# EasyEDA Pro project JLCEDA_AT_START_A423_V1.1.epro, board AT-START-A423 V1.1
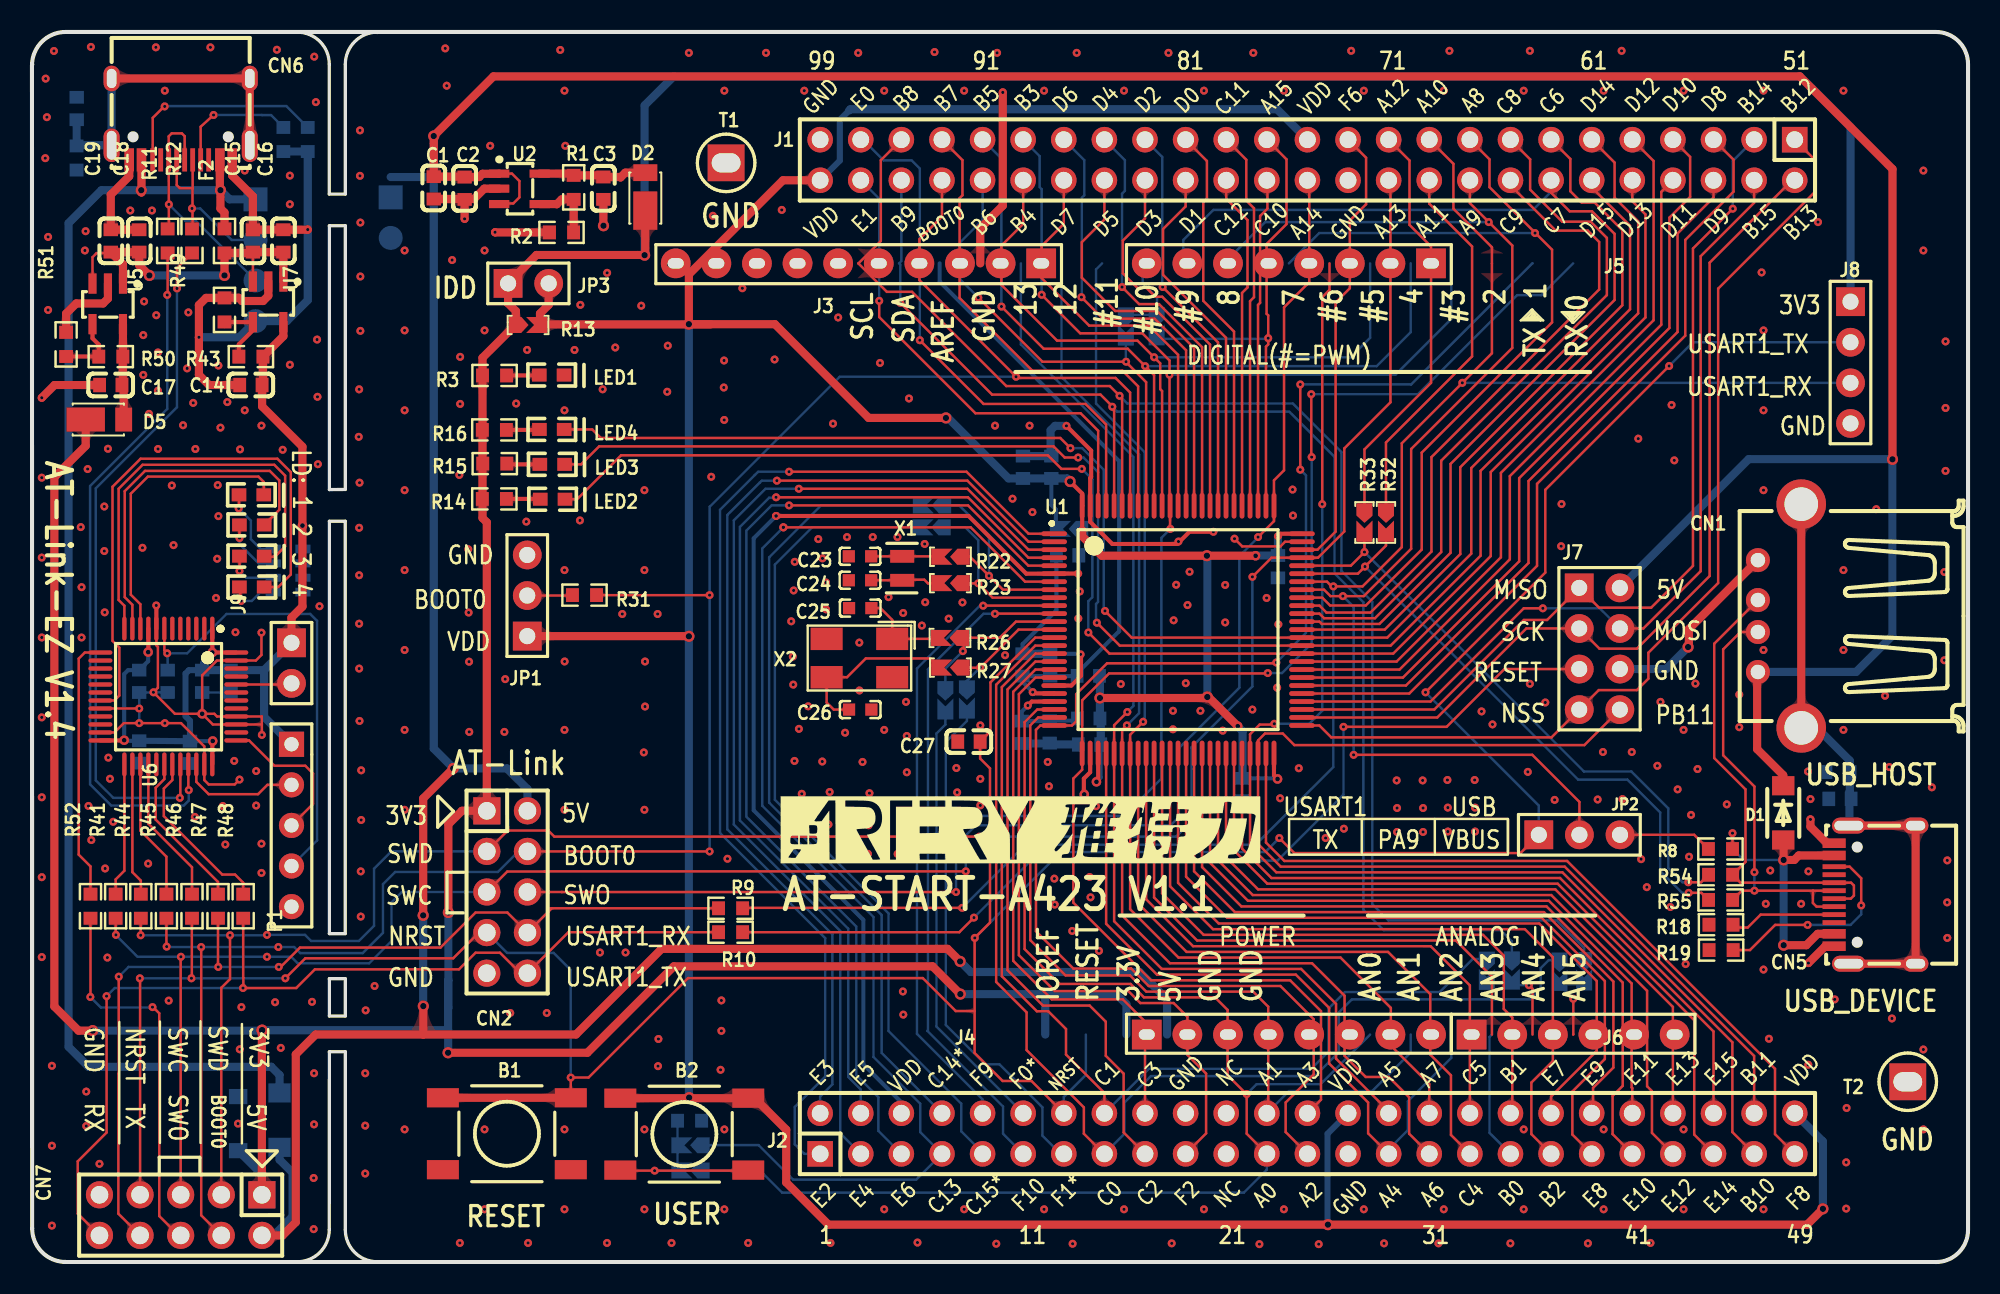
[diagram p4: board, top side]
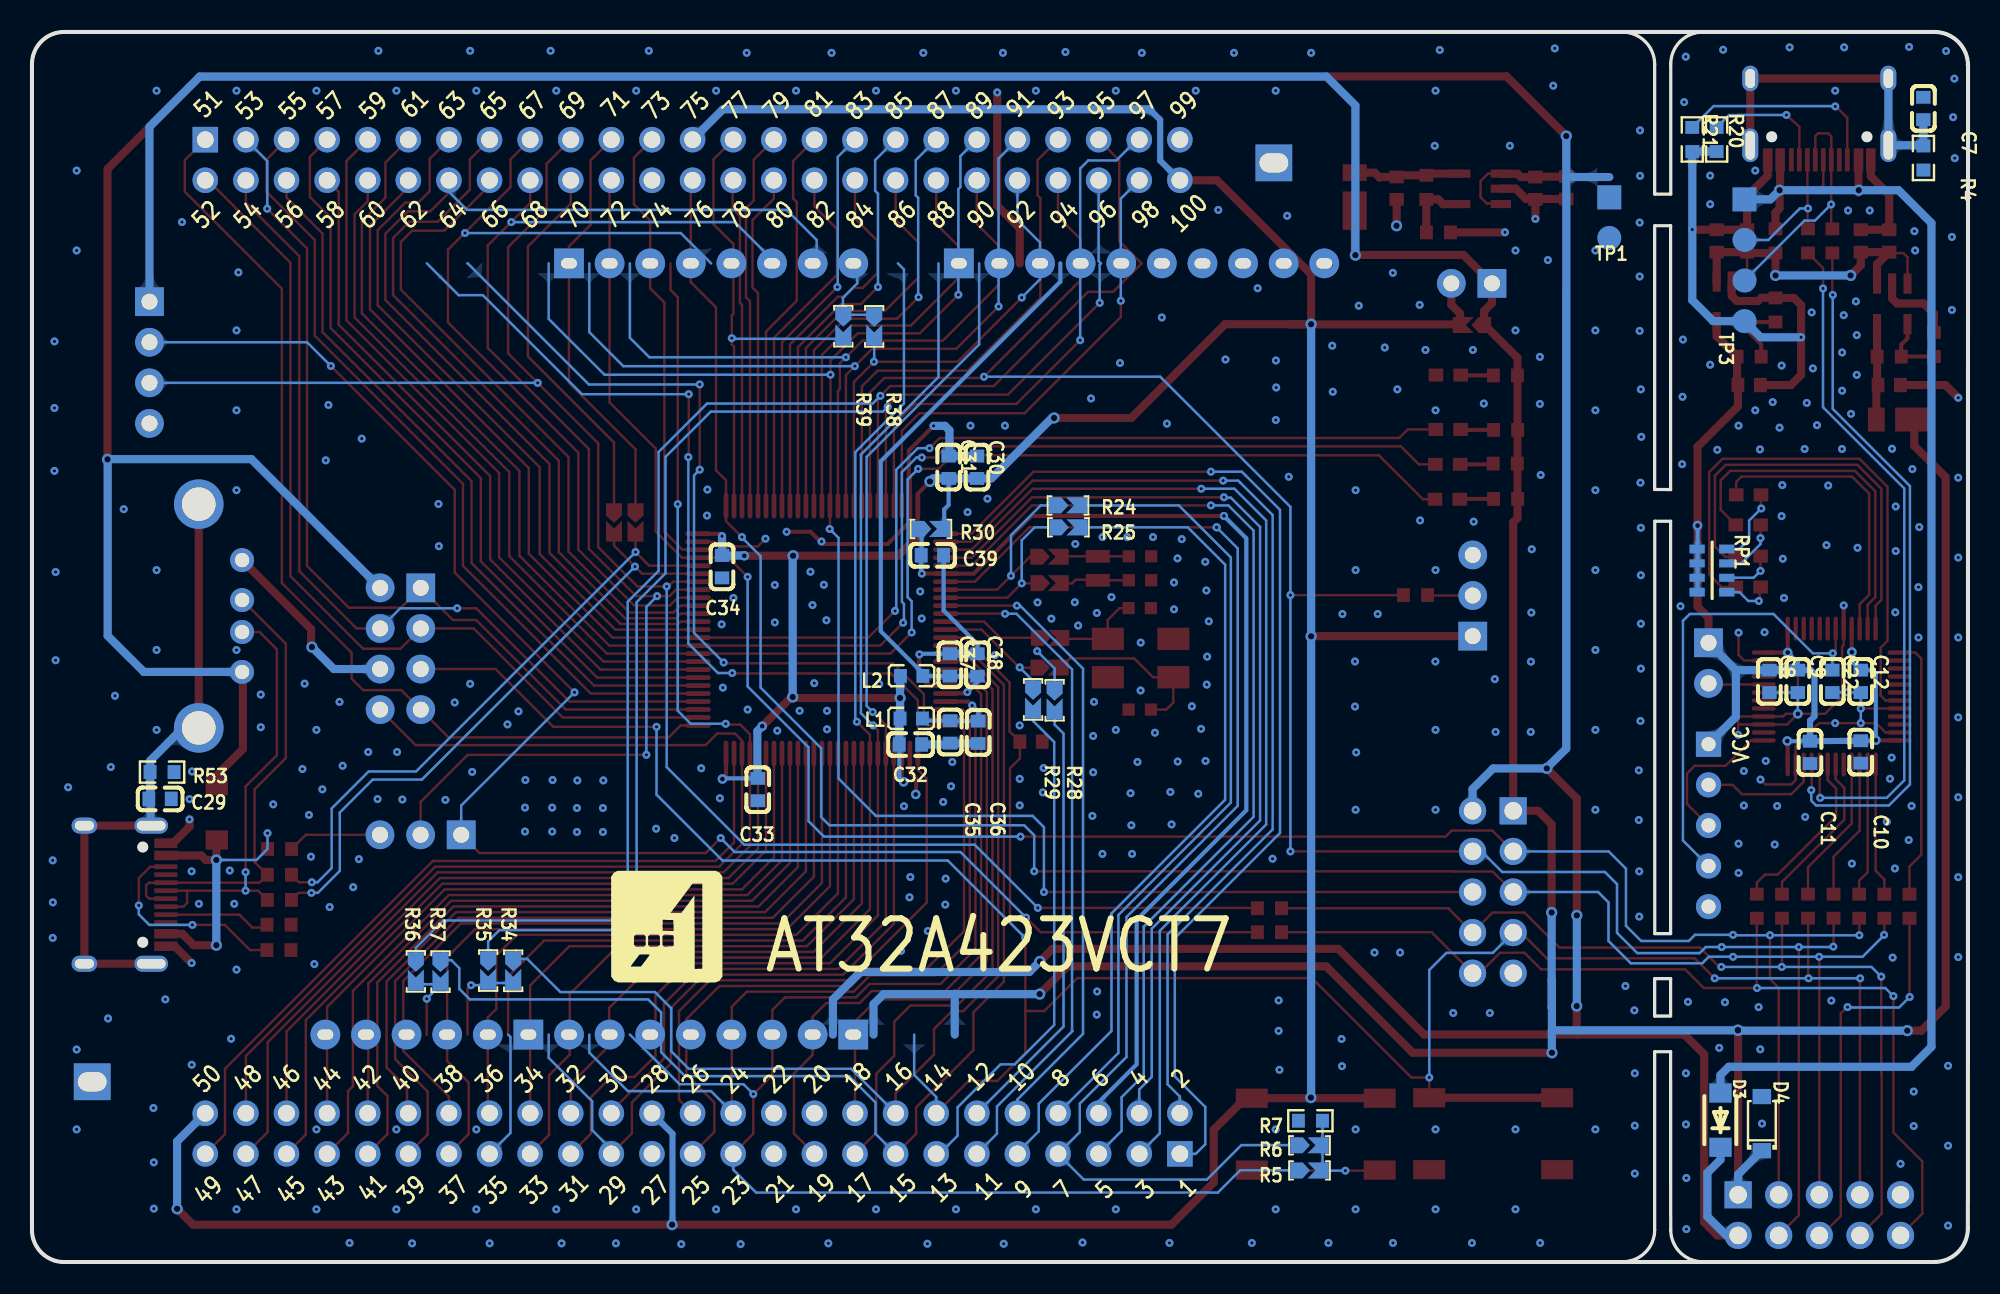
[diagram p5: board, bottom side, seen from below]

Outline 121.1 x 76.98 mm; copper layers: Top Layer, Bottom Layer. Coordinates in mm from the lower left corner of the outline.
Outline path: 0,74.87 0.01,2.11 arc(0.63,0.62) 2.12,0 ; 0,74.87 arc(0,74.9) 0.02,74.93 ; 0,74.87 arc(0.62,76.36) 2.1,76.98 119.09,76.98 arc(120.51,76.39) 121.1,74.97 121.1,2.01 arc(120.51,0.59) 119.09,0 119.09,0 21.6,0 ; 2.12,0 arc(2.1,0) 2.09,0.01 ; 2.12,0 21.57,0 arc(21.58,0) 21.6,0 ; 16.6,76.96 arc(18.01,76.38) 18.6,74.96 18.6,66.83 19.6,66.83 19.6,74.96 arc(20.19,76.37) 21.6,76.97 arc(21.6,76.97) 21.6,76.98 ; 16.52,0.02 arc(17.98,0.58) 18.6,2.02 18.6,13.16 19.6,13.16 19.6,2.02 arc(20.19,0.6) 21.6,0.02 ; 21.6,0 arc(21.59,0) 21.58,0 ; 18.6,20.55 19.59,20.55 19.59,46.36 18.6,46.36 18.6,20.55 ; 18.6,17.73 18.6,15.4 19.6,15.4 19.6,17.73 18.6,17.73 ; 18.6,64.85 18.6,48.34 19.6,48.35 19.6,64.85 18.6,64.85
Stack: Top Layer 0.035mm / Dielectric1 1.51mm FR4 er 4.5 / Bottom Layer 0.035mm

## Design rules (mm)
spacing Default (default): track to track 0.203, other pairs 0 to 0.152
track width Default (default): min 0.152, default 0.152, max 25.4
differential pair differentialPair (default): width min 0.127, default 0.254, max 2.54; gap min 0.152, default 0.152
via Default (default): diameter min 0.5, default 0.5, max 100.025; hole min 0.201, default 0.201, max 59.995

## Placement (name value [footprint] x y rotation side)
B1  BUTTON_SMT,6.0x6.0x4.5mm  [BUTTON_SMT_6*6*5]  29.7 8.03 0 top
B2  BUTTON_SMT,6.0x6.0x4.5mm  [BUTTON_SMT_6*6*5]  40.8 8 0 top
C1  10uF  [C0603]  25.13 67.22 90 top
C2  100nF  [C0603]  27.06 67.2 90 top
C3  10uF  [C0603]  35.74 67.2 90 top
C7  100nF  [C0603]  2.79 72.19 270 bottom
C8  4.7uF  [C0603]  12.42 36.34 90 bottom
C9  100nF  [C0603]  10.64 36.34 90 bottom
C10  100nF  [C0603]  6.71 31.92 90 bottom
C11  100nF  [C0603]  9.88 31.89 90 bottom
C12  100nF  [C0603]  6.71 36.34 90 bottom
C14  10uF  [C0603]  13.69 54.88 0 top
C15  10uF  [C0603]  13.82 63.9 270 top
C16  100nF  [C0603]  15.73 63.9 270 top
C17  10uF  [C0603]  4.93 54.88 0 top
C18  10uF  [C0603]  6.71 63.9 270 top
C19  100nF  [C0603]  4.93 63.9 270 top
C22  100nF  [C0603]  8.49 36.34 90 bottom
C23  10pF  [0603_C-M]  51.79 44.16 180 top
C24  10pF  [0603_C-M]  51.79 42.66 180 top
C25  22pF  [0603_C-M(1)]  51.81 40.92 180 top
C26  22pF  [0603_C-M(1)]  51.81 34.57 0 top
C27  100nF  [C0603]  58.61 32.57 0 top
C29  100nF  [C0603]  113.09 28.98 0 bottom
C30  4.7uF  [C0603]  61.99 49.74 270 bottom
C31  100nF  [C0603]  63.76 49.74 270 bottom
C32  100nF  [C0603]  66.15 32.39 0 bottom
C33  100nF  [C0603]  75.7 29.57 90 bottom
C34  100nF  [C0603]  77.94 43.51 90 bottom
C35  1uF  [C0603]  63.66 33.18 90 bottom
C36  100nF  [C0603]  61.91 33.15 90 bottom
C37  1uF  [C0603]  63.69 37.37 270 bottom
C38  100nF  [C0603]  61.96 37.37 270 bottom
C39  100nF  [C0603]  64.78 44.22 0 bottom
CN1  902-131A1011D10100  [USB-A-TH__USB-AF-90]  109.31 40.43 90 top
CN2  -  [HDR-TH_10P-P2.54-V-M-R2-C5-S2.54]  29.72 23.16 270 top
CN5  -  [USB-C-SMD_TYPEC-304-BCP16]  115.28 22.99 90 top
CN6  -  [USB-C-SMD_TYPEC-304-BCP16]  9.3 71.52 180 top
CN7  -  [HDR-TH_10P-P2.54-V-M-R2-C5-S2.54]  9.3 2.94 180 top
D1  1N5819HW-7-F  [SOD-123_L2.8-W1.8-LS3.7-FD]  109.54 28.11 90 top
D2  DFLS130L-7  [POWERDI-123_L2.8-W1.8-LS3.7-RD]  38.36 66.98 90 top
D3  1N5819HW-7-F  [SOD-123_L2.8-W1.8-LS3.7-FD]  15.49 8.88 270 bottom
D4  SMF3.3A  [SOD-123_L2.8-W1.8-LS3.7-RD]  12.9 8.66 90 bottom
D5  DFLS130L-7  [POWERDI-123_L2.8-W1.8-LS3.7-RD]  4.55 52.72 0 top
F2  SMD0603B050TF  [R0603]  12.04 63.9 270 top
J1  X6521WV-2x25H-C30D60  [HDR-TH_50P-2.54-V-M-R2-C25-S2.54]  79.78 68.96 180 top
J2  X6521WV-2x25H-C30D60  [HDR-TH_50P-2.54-V-M-R2-C25-S2.54]  79.78 8.04 0 top
J3  -  [AT-START-Connector 1x10]  63.13 62.5 180 top
J4  -  [AT-START-Connector 1x8]  69.73 14.24 0 top
J5  -  [AT-START-Connector 1x8]  87.51 62.5 180 top
J6  -  [AT-START-Connector 1x6]  90.05 14.24 0 top
J7  Header 4X2  [HDR2X4]  96.78 42.19 270 top
J8  Header 1x4  [HDR1X4]  113.75 60.1 270 top
J9  1X2P,Male,DIP_2.54  [HDR1X2]  16.23 38.75 270 top
JP1  Header 1x3  [HEADER 1X3]  30.98 39.17 90 top
JP2  Header 1x3  [HEADER 1X3]  94.25 26.74 0 top
JP3  NC(Header 1x2)  [HDR1X2]  29.78 61.24 0 top
L1  -  [L0603]  66.1 34.01 180 bottom
L2  -  [L0603]  66.08 36.68 180 bottom
LD1  RED  [LED0603]  12.95 48 0 top
LD2  GREEN  [LED0603]  12.98 46.12 0 top
LD3  BLUE  [LED0603]  12.98 44.17 0 top
LD4  YELLOW  [LED0603]  12.98 42.24 0 top
LED1  RED  [LED0603]  31.73 55.5 0 top
LED2  RED  [LED0603]  31.79 47.73 0 top
LED3  YELLOW  [LED0603]  31.77 49.91 0 top
LED4  GREEN  [LED0603]  31.74 52.1 0 top
P1  HDR-M-2.54_1x5  [HDR-M-2.54_1X5]  16.23 27.32 270 top
R1  51kΩ  [R0603]  33.89 67.25 90 top
R2  15kΩ  [R0603]  33.12 64.43 0 top
R3  1kΩ  [R0603]  28.94 55.48 180 top
R4  1MΩ  [R0603]  2.79 69.09 270 bottom
R5  0Ω  [SB-PAD]  41.19 5.73 180 bottom
R6  NC  [SB-PAD]  41.19 7.31 180 bottom
R7  100kΩ  [R0603]  41.13 8.84 180 bottom
R8  10kΩ  [R0603]  105.61 25.85 0 top
R9  470Ω  [R0603]  43.7 22.14 0 top
R10  470Ω  [R0603]  43.7 20.64 0 top
R11  0Ω  [R0603]  8.49 63.9 270 top
R12  0Ω  [R0603]  10.01 63.9 270 top
R13  0Ω  [SB-PAD]  31.03 58.64 0 top
R14  1kΩ  [R0603]  28.92 47.75 180 top
R15  1kΩ  [R0603]  28.95 49.96 180 top
R16  1kΩ  [R0603]  28.92 52.07 180 top
R18  5.1kΩ  [R0603]  105.65 21.11 180 top
R19  5.1kΩ  [R0603]  105.66 19.52 180 top
R20  5.1kΩ  [R0603]  15.73 70.25 270 bottom
R21  5.1kΩ  [R0603]  17.25 70.25 270 bottom
R22  0Ω  [SB-PAD]  57.45 44.14 180 top
R23  0Ω  [SB-PAD]  57.45 42.48 180 top
R24  NC  [SB-PAD]  56.3 47.35 180 bottom
R25  NC  [SB-PAD]  56.27 45.98 180 bottom
R26  0Ω  [SB-PAD]  57.42 39.06 180 top
R27  0Ω  [SB-PAD]  57.45 37.2 180 top
R28  NC  [SB-PAD]  57.13 35.15 270 bottom
R29  NC  [SB-PAD]  58.48 35.21 270 bottom
R30  0Ω  [SB-PAD]  64.87 45.88 180 bottom
R31  10kΩ  [R0603]  34.56 41.73 0 top
R32  NC  [SB-PAD]  84.69 46.28 270 top
R33  NC  [SB-PAD]  83.35 46.28 270 top
R34  0Ω  [sb-pad]  91 18.23 270 bottom
R35  NC  [sb-pad]  92.57 18.24 270 bottom
R36  NC  [sb-pad]  97.09 18.19 270 bottom
R37  0Ω  [sb-pad]  95.55 18.17 270 bottom
R38  NC  [SB-PAD]  68.42 58.55 270 bottom
R39  0Ω  [SB-PAD]  70.35 58.56 270 bottom
R41  33Ω  [R0603]  5.23 22.27 270 top
R43  47kΩ  [R0603]  13.69 56.66 0 top
R44  33Ω  [R0603]  6.81 22.27 270 top
R45  33Ω  [R0603]  8.41 22.27 270 top
R46  33Ω  [R0603]  10.01 22.27 270 top
R47  33Ω  [R0603]  11.64 22.27 270 top
R48  33Ω  [R0603]  13.21 22.27 270 top
R49  15kΩ  [R0603]  12.04 59.58 270 top
R50  51kΩ  [R0603]  4.93 56.66 0 top
R51  15kΩ  [R0603]  2.14 57.42 270 top
R52  33Ω  [R0603]  3.66 22.27 270 top
R53  1MΩ  [R0603]  112.96 30.66 180 bottom
R54  0Ω  [R0603]  105.62 24.23 0 top
R55  0Ω  [R0603]  105.62 22.66 0 top
RP1  1K  [0603*4,8P4R]  16.94 44.62 270 bottom
T1  Testpoint  [TESTHOOK]  43.42 68.79 0 top
T2  Testpoint  [TESTHOOK]  117.33 11.28 180 top
TP1  -  [AT-START-TEST-POINT 1X2]  22.44 66.63 270 bottom
TP3  1X4P_2.54F  [HDR1X4 - TOP]  13.98 66.5 90 bottom
U1  -  [LQFP-100_L14.0-W14.0-P0.50-LS16.0-TL]  71.69 39.58 0 top
U2  RT9080N-08GJ5  [SOT-23-5(1)]  30.87 65.57 0 top
U5  RT9080N-08GJ5  [SOT-23-5]  3.15 59.58 270 top
U6  -  [LQFP-48_L7.0-W7.0-P0.50-LS9.0-BL]  8.53 35.39 180 top
U7  RT9080N-08GJ5  [SOT-23-5(1)]  13.19 59.71 270 top
X1  32.768KHz  [XTAL_SOP - FC-12M]  54.43 44.16 270 top
X2  8MHz  [OSC-SMD_4P-L5.0-W3.2-BL]  51.76 37.8 180 top

## Footprints (pads in the part's own frame, mm; a bottom-side part is the same pattern mirrored in y, then rotated)
0603*4,8P4R
  rect 0.55x0.95 smd: 1(0,0) 4(2.7,0) 5(2.7,1.85) 8(0,1.85)
  rect 0.5x0.95 smd: 2(0.9,0) 3(1.8,0) 6(1.8,1.85) 7(0.9,1.85)
0603_C-M
  rect 0.762x0.762 smd: 1(0.699,0) 2(-0.699,0)
0603_C-M(1)
  rect 0.762x0.762 smd: 1(0.699,0) 2(-0.699,0)
AT-START-Connector 1x6
  rect 1.86x1.86 hole 1x0.65: 1(0,0)
  round 1.86 hole 1x0.65: 2(2.54,0) 3(5.08,0) 4(7.62,0) 5(10.16,0) 6(12.7,0)
AT-START-Connector 1x8
  rect 1.86x1.86 hole 1x0.65: 1(0,0)
  round 1.86 hole 1x0.65: 2(2.54,0) 3(5.08,0) 4(7.62,0) 5(10.16,0) 6(12.7,0) 7(15.24,0) 8(17.78,0)
AT-START-Connector 1x10
  rect 1.86x1.86 hole 1x0.65: 1(0,0)
  round 1.86 hole 1x0.65: 2(2.54,0) 3(5.08,0) 4(7.62,0) 5(10.16,0) 6(12.7,0) 7(15.24,0) 8(17.78,0) 9(20.32,0) 10(22.86,0)
AT-START-TEST-POINT 1X2
  rect 1.5x1.5 smd: 1(0,0)
  round 1.5 smd: 2(2.54,0)
BUTTON_SMT_6*6*5
  rect 2x1.2 smd: 1(-4,2.25) 2(4,2.25) 3(-4,-2.25) 4(4,-2.25)
C0603
  rect 0.8x0.9 smd: 1(-0.7,0) 2(0.7,0)
HDR1X2
  rect 1.8x1.8 hole 1.005x1: 1(0,0)
  round 1.8 hole 1.005x1: 2(2.54,0)
HDR1X4
  rect 1.8x1.8 hole 1: 1(0,0)
  round 1.8 hole 1: 2(2.54,0) 3(5.08,0) 4(7.62,0)
HDR1X4 - TOP
  rect 1.5x1.5 smd: 1(0,0)
  round 1.5 smd: 2(-2.54,0) 3(-5.08,0) 4(-7.62,0)
HDR2X4
  rect 1.8x1.8 hole 1: 1(0,0)
  round 1.8 hole 1: 2(0,2.54) 3(2.54,0) 4(2.54,2.54) 5(5.08,0) 6(5.08,2.54) 7(7.62,0) 8(7.62,2.54)
HDR-M-2.54_1X5
  rect 1.575x1.575 hole 0.889: 1(-5.08,0)
  round 1.575 hole 0.889: 2(-2.54,0) 3(0,0) 4(2.54,0) 5(5.08,0)
HDR-TH_10P-P2.54-V-M-R2-C5-S2.54
  rect 1.7x1.7 hole 1.1: 1(-5.08,-1.27)
  round 1.7 hole 1.1: 2(-5.08,1.27) 3(-2.54,-1.27) 4(-2.54,1.27) 5(0,-1.27) 6(0,1.27) 7(2.54,-1.27) 8(2.54,1.27) 9(5.08,-1.27) 10(5.08,1.27)
HDR-TH_50P-2.54-V-M-R2-C25-S2.54
  rect 1.6x1.6 hole 1.049: 1(-30.48,-1.27)
  round 1.6 hole 1.049: 2(-30.48,1.27) 3(-27.94,-1.27) 4(-27.94,1.27) 5(-25.4,-1.27) 6(-25.4,1.27) 7(-22.86,-1.27) 8(-22.86,1.27) 9(-20.32,-1.27) 10(-20.32,1.27) 11(-17.78,-1.27) 12(-17.78,1.27) 13(-15.24,-1.27) 14(-15.24,1.27) 15(-12.7,-1.27) 16(-12.7,1.27) 17(-10.16,-1.27) 18(-10.16,1.27) 19(-7.62,-1.27) 20(-7.62,1.27) 21(-5.08,-1.27) 22(-5.08,1.27) 23(-2.54,-1.27) 24(-2.54,1.27) 25(0,-1.27) 26(0,1.27) 27(2.54,-1.27) 28(2.54,1.27) 29(5.08,-1.27) 30(5.08,1.27) 31(7.62,-1.27) 32(7.62,1.27) 33(10.16,-1.27) 34(10.16,1.27) 35(12.7,-1.27) 36(12.7,1.27) 37(15.24,-1.27) 38(15.24,1.27) 39(17.78,-1.27) 40(17.78,1.27) 41(20.32,-1.27) 42(20.32,1.27) 43(22.86,-1.27) 44(22.86,1.27) 45(25.4,-1.27) 46(25.4,1.27) 47(27.94,-1.27) 48(27.94,1.27) 49(30.48,-1.27) 50(30.48,1.27)
HEADER 1X3
  rect 1.8x1.8 hole 1.005x1: 1(0,-0.001)
  round 1.8 hole 1.005x1: 2(2.54,-0.001) 3(5.08,-0.001)
L0603
  rect 0.8x0.864 smd: 1(-0.701,0) 2(0.701,0)
LED0603
  rect 0.914x0.813 smd: 1(-0.001,0.005) 2(1.548,0.005)
LQFP-48_L7.0-W7.0-P0.50-LS9.0-BL
  oval 0.27x1.5 smd: 1(-2.75,-4.25) 2(-2.25,-4.25) 3(-1.75,-4.25) 4(-1.25,-4.25) 5(-0.75,-4.25) 6(-0.25,-4.25) 7(0.25,-4.25) 8(0.75,-4.25) 9(1.25,-4.25) 10(1.75,-4.25) 11(2.25,-4.25) 12(2.75,-4.25) 25(2.75,4.25) 26(2.25,4.25) 27(1.75,4.25) 28(1.25,4.25) 29(0.75,4.25) 30(0.25,4.25) 31(-0.25,4.25) 32(-0.75,4.25) 33(-1.25,4.25) 34(-1.75,4.25) 35(-2.25,4.25) 36(-2.75,4.25)
  oval 1.5x0.27 smd: 13(4.25,-2.75) 14(4.25,-2.25) 15(4.25,-1.75) 16(4.25,-1.25) 17(4.25,-0.75) 18(4.25,-0.25) 19(4.25,0.25) 20(4.25,0.75) 21(4.25,1.25) 22(4.25,1.75) 23(4.25,2.25) 24(4.25,2.75) 37(-4.25,2.75) 38(-4.25,2.25) 39(-4.25,1.75) 40(-4.25,1.25) 41(-4.25,0.75) 42(-4.25,0.25) 43(-4.25,-0.25) 44(-4.25,-0.75) 45(-4.25,-1.25) 46(-4.25,-1.75) 47(-4.25,-2.25) 48(-4.25,-2.75)
LQFP-100_L14.0-W14.0-P0.50-LS16.0-TL
  oval 1.6x0.299 smd: 1(-7.75,6) 2(-7.75,5.499) 3(-7.75,5.002) 4(-7.75,4.501) 5(-7.75,4) 6(-7.75,3.5) 7(-7.75,2.999) 8(-7.75,2.499) 9(-7.75,1.999) 10(-7.75,1.501) 11(-7.75,1.001) 12(-7.75,0.5) 13(-7.75,0) 14(-7.75,-0.5) 15(-7.75,-1.001) 16(-7.75,-1.501) 17(-7.75,-1.999) 18(-7.75,-2.499) 19(-7.75,-2.999) 20(-7.75,-3.5) 21(-7.75,-4) 22(-7.75,-4.501) 23(-7.75,-4.998) 24(-7.75,-5.499) 25(-7.75,-6) 51(7.75,-6) 52(7.75,-5.499) 53(7.75,-4.998) 54(7.75,-4.501) 55(7.75,-4) 56(7.75,-3.5) 57(7.75,-2.999) 58(7.75,-2.499) 59(7.75,-1.999) 60(7.75,-1.501) 61(7.75,-1.001) 62(7.75,-0.5) 63(7.75,0) 64(7.75,0.5) 65(7.75,1.001) 66(7.75,1.501) 67(7.75,1.999) 68(7.75,2.499) 69(7.75,2.999) 70(7.75,3.5) 71(7.75,4) 72(7.75,4.501) 73(7.75,5.002) 74(7.75,5.499) 75(7.75,6)
  oval 0.299x1.6 smd: 26(-6,-7.75) 27(-5.499,-7.75) 28(-4.998,-7.75) 29(-4.501,-7.75) 30(-4,-7.75) 31(-3.5,-7.75) 32(-2.999,-7.75) 33(-2.499,-7.75) 34(-1.999,-7.75) 35(-1.501,-7.75) 36(-1.001,-7.75) 37(-0.5,-7.75) 38(0,-7.75) 39(0.5,-7.75) 40(1.001,-7.75) 41(1.501,-7.75) 42(1.999,-7.75) 43(2.499,-7.75) 44(2.999,-7.75) 45(3.5,-7.75) 46(4,-7.75) 47(4.501,-7.75) 48(5.002,-7.75) 49(5.499,-7.75) 50(6,-7.75) 76(6,7.75) 77(5.499,7.75) 78(5.002,7.75) 79(4.501,7.75) 80(4,7.75) 81(3.5,7.75) 82(2.999,7.75) 83(2.499,7.75) 84(1.999,7.75) 85(1.501,7.75) 86(1.001,7.75) 87(0.5,7.75) 88(0,7.75) 89(-0.5,7.75) 90(-1.001,7.75) 91(-1.501,7.75) 92(-1.999,7.75) 93(-2.499,7.75) 94(-2.999,7.75) 95(-3.5,7.75) 96(-4,7.75) 97(-4.501,7.75) 98(-4.998,7.75) 99(-5.499,7.75) 100(-6,7.75)
OSC-SMD_4P-L5.0-W3.2-BL
  rect 2x1.4 smd: 1(-2.05,-1.2) 2(2.05,-1.2) 3(2.05,1.2) 4(-2.05,1.2)
POWERDI-123_L2.8-W1.8-LS3.7-RD
  rect 2.4x1.5 smd: 1(-1.188,0)
  rect 1.05x1.5 smd: 2(1.188,0)
R0603
  rect 0.806x0.864 smd: 1(-0.753,0) 2(0.753,0)
SB-PAD
  custom 1.226x1 smd: 1(-0.587,0)
  custom 1.319x1 smd: 2(0.54,0)
sb-pad
  custom 1.319x1 smd: 1(0.54,0)
  custom 1.226x1 smd: 2(-0.587,0)
SOD-123_L2.8-W1.8-LS3.7-FD
  rect 1.199x1.399 smd: 1(-1.7,0) 2(1.7,0)
SOD-123_L2.8-W1.8-LS3.7-RD
  rect 0.95x1.15 smd: 1(-1.692,0) 2(1.692,0)
SOT-23-5
  rect 1.27x0.508 smd: 1(-1.651,2.54) 2(-1.651,1.6) 3(-1.651,0.635) 4(0.889,0.635) 5(0.889,2.54)
SOT-23-5(1)
  rect 1.27x0.508 smd: 1(-1.651,2.54) 2(-1.651,1.6) 3(-1.651,0.635) 4(0.889,0.635) 5(0.889,2.54)
TESTHOOK
  rect 2.3x2.3 hole 1.8x1.2: 1(0,0)
USB-A-TH__USB-AF-90
  round 1.5 hole 0.9: 1(-3.5,1.355) 2(-1,1.355) 3(1,1.355) 4(3.5,1.355)
  round 3.1 hole 2.1: SH1(7,-1.355) SH2(-7,-1.355)
USB-C-SMD_TYPEC-304-BCP16
  oval 1.001x2.1 hole 0.6x1.801: 13(-4.321,1.633) 14(4.321,1.633)
  oval 1.001x1.6 hole 0.6x1.199: 15(-4.321,-2.547) 16(4.321,-2.547)
  rect 0.6x1.45 smd: A1B12(-3.226,2.547) A4B9(-2.451,2.547) B1A12(3.22,2.547) B4A9(2.451,2.547)
  rect 0.299x1.45 smd: A5(-1.25,2.547) A6(-0.249,2.547) A7(0.249,2.547) A8(1.25,2.547) B5(1.75,2.547) B6(0.75,2.547) B7(-0.75,2.547) B8(-1.75,2.547)
XTAL_SOP - FC-12M
  rect 0.8x1.5 smd: 1(0,0) 2(1.5,0)

## Nets
As in the schematic, except:
VBAT: C39.2 J2.6 R30.1 U1.6
VDD: B2.1 B2.2 C30.2 C31.2 C32.2 C33.2 C34.2 J1.25 J1.50 J2.28 J2.50 JP1.1 JP3.2 L1.1 L2.1 R13.2 R30.2 U1.28 U1.50 U1.75 U1.100

Pads without a net: CN5 A8 B8; CN6 A8 B8; J2 21 22; J4 1 8; U6 2 3 4 5 6 14 15 16 17 18 21 22 29 38 41 42 43 45 46

## Via types
v1: diameter 0.5, hole 0.201, Top Layer to Bottom Layer, 187 vias
v2: diameter 0.5, hole 0.2, Top Layer to Bottom Layer, 387 vias
v3: diameter 0.6, hole 0.3, Top Layer to Bottom Layer, 11 vias
v4: diameter 0.7, hole 0.4, Top Layer to Bottom Layer, 31 vias

## Routing (per net, layer and track width the routed paths; a pad name or vN(x,y) marks a point on that pad's centre or on a via; arc(x,y) is an arc through that point)
3V3: length 289.6
  Top Layer w0.254: 28.17,49.99 R15.2 ; 28.2,47.78 R14.2
  Top Layer w0.508: 28.18,52.08 R3.2 28.18,56.59 30.27,58.68 30.27,59.51 29.78,60 JP3.1 31.56,63.02 38.31,63.02 v4(38.32,63.01) 38.36,63.05 D2.1 ; 28.18,52.08 R16.2 ; 28.18,52.08 28.18,46.56 28.45,46.29 CN2.1 26.89,28.24 26.05,27.39 v4(26.05,21.87) ; v4(26.03,13.1) 34.74,13.1 40.15,18.51 56.33,18.51 v4(58.07,16.77) ; v4(3.8,14.48) 2.91,14.48 1.4,15.99 1.4,49.12 3.36,51.08 D5.1 ; 14.38,14.49 CN7.1
  Bottom Layer w0.508: 68.46,14.24 68.46,16.13 67.83,16.77 63.41,16.77 ; 26.05,17.63 26.05,15.9 26.03,15.9 ; 26.05,17.63 v4(26.05,21.87) ; 26.05,17.63 26.03,17.61 26.03,15.9 ; v4(38.32,63.01) 38.32,72.38 40.12,74.18 110.61,74.18 113.75,71.04 J8.1 ; 26.03,14.51 v4(14.39,14.51) 14.37,14.48 v4(3.8,14.48) ; 26.03,14.51 26.03,13.1 v4(26.03,13.1) ; 26.03,14.51 26.03,14.51 26.03,15.9 ; 63.38,16.77 v4(58.07,16.77) 58.06,16.78 ; 63.38,16.77 63.38,14.24 ; 63.38,16.77 63.41,16.77 ; D4.1 14.38,5.49 CN7.1 ; 63.41,16.77 63.38,16.79
5V: length 320.1
  Top Layer w0.152: U2.1 30.02,68.11 30.49,67.64 30.49,66.63 30.11,66.25 29.26,66.25 U2.3
  Top Layer w0.508: U2.1 29.21,68.1 28.18,68.1 27.97,67.9 C2.2 27.04,67.92 C1.2 v4(25.13,70.46) 28.86,74.2 110.58,74.2 116.38,68.4 v4(116.38,50.23) ; D1.2 109.54,30.46 107.91,32.1 107.91,36.88 CN1.1 ; 24.48,14.24 34.03,14.24 39.39,19.6 57.27,19.6 v4(58.06,18.81) ; 24.48,14.24 24.48,14.24 v4(24.48,16.02) ; 24.48,14.24 17.75,14.24 16.5,12.99 16.5,2.49 15.68,1.67 CN7.2 ; v4(26.35,30.89) 24.47,29.01 v4(24.47,21.69)
  Bottom Layer w0.508: v4(58.06,18.81) 58.72,18.15 69.28,18.15 71,16.43 71,14.24 ; CN7.2 15.12,1.67 16.3,2.85 16.3,5.59 15.49,6.4 D3.2 ; J7.2 107.38,50.24 116.37,50.24 116.37,39.2 114.1,36.93 CN1.1 ; 25.13,67.87 25.1,67.9 22.44,67.9 ; v4(24.47,21.69) 24.47,16.03 v4(24.48,16.02) ; CN2.2 30.99,29.6 29.7,30.89 26.38,30.89 25.13,32.13 v4(25.13,70.46)
GND: length 185.9
  Top Layer w0.152: 14.38,33.64 v2(14.38,32.99) ; 14.38,33.64 14.38,34.14 U6.40 11.57,34.14 11.41,34.31 v3(10.64,34.31) ; 14.38,33.64 U6.39 11.31,33.64 v3(10.64,34.31) ; U6.23 5.16,33.14 5.74,33.72 v2(6.71,33.72) v2(8.31,33.72) 9.32,33.72 10.78,32.27 U6.35 10.78,30.16 11.05,29.89 12.68,29.89 v2(12.98,30.19) ; U1.74 78.38,45.08 78.09,44.78 75.7,44.78 v2(75.22,45.27) ; v3(10.64,34.31) 10.64,36.72 11.57,37.64 U6.47 14,37.64 14.35,37.99 v2(14.35,39.39) ; v3(10.64,34.31) 8.94,34.31 v2(7.6,35.65) 7.88,35.93 7.88,38.5 7.78,38.59 U6.8 ; v2(6.71,34.64) 6.7,34.64 U6.20
  Top Layer w0.254: U6.8 7.78,41.08 v2(7.78,41.09) ; v2(64.7,52.33) 66.25,50.78 66.25,49.13 66.19,49.06 U1.99 66.19,46.32 67.57,44.94 71.64,44.94 72.4,45.7 v1(73.9,45.7) ; v3(65.82,29.26) 65.8,29.29 65.8,30.25 66.19,30.65 U1.27 ; v2(65.59,38.03) 65.62,38 65.62,36.68 65.01,36.08 U1.20
  Top Layer w0.508: v1(28.97,64.44) 28.98,64.43 R2.1 ; v2(60.72,73.19) 60.72,66.1 59.32,64.69 59.32,62.5 ; U7.2 14.78,60.47 14.45,60.14 13.13,60.14 12.93,60.34 12.05,60.34 R49.1 10.89,60.33 10.44,59.89 v2(10.44,57.87) 10.44,55.52 11.08,54.88 C14.1 ; CN5.A1B12 112.17,19.76 v1(111.12,18.71) ; CN6.B1A12 6.08,67.95 4.93,66.79 C19.1 C18.1 ; 27.06,65.28 C2.1 27.04,66.52 ; U5.2 4.75,60.29 4.45,59.99 2.77,59.99 2.14,59.35 R51.1 ; C17.1 1.41,54.88 v2(0.61,54.08) ; 25.13,66.52 27.04,66.52 ; 27.04,66.52 27.64,66.52 28.29,67.17 U2.2 ; v4(35.75,64.85) 35.74,64.86 C3.1 ; CN5.B1A12 112.28,26.21 111.24,27.24 v1(111.24,27.7) ; CN1.4 103.64,39.61 103.64,38.53 v4(103.59,38.48) ; CN6.A1B12 12.53,67.98 13.82,66.69 C15.1 C16.1 17.24,64.6 v2(17.25,64.61)
  Bottom Layer w0.152: v2(6.71,33.72) v2(6.71,34.64) C12.1 7.58,35.64 v2(7.6,35.65) 8.47,35.65 C22.1 ; v3(10.64,34.31) C9.1 C8.1
  Bottom Layer w0.254: C38.1 61.96,38.66 64.08,40.78 C39.1 ; v2(65.59,38.03) 65.55,38.07 C37.1
  Bottom Layer w0.508: v2(64.7,52.33) 63.99,52.33 63.71,52.05 63.71,50.49 C31.1 C30.1 ; C32.1 63.7,32.39 63.64,32.45 ; 63.64,32.45 C35.1 ; 63.64,32.45 C36.1 ; R20.2 R21.2 v2(17.25,64.61) 17.25,60.19 15.94,58.88 TP3.4 12.97,57.87 v2(10.44,57.87) ; J7.6 102.22,37.11 v4(103.59,38.48) ; C38.1 C37.1
  vias: v1(26.28,62.7) v1(26.73,49.25) v1(26.78,56.64) v1(26.78,53.7) v1(27.29,44.61) v1(27.31,40.64) v1(27.34,37.57) v1(27.35,33.18) v1(28.66,69.85) v1(29.55,33.18) v1(29.6,36.48) v1(30.29,53.72) v1(30.92,46.33) v1(30.97,57.08) v1(33.36,69.85) v1(33.94,57.08) v1(34.3,59.9) v1(34.27,46.41) v1(35.7,54.61) v1(35.98,61.9) v1(36.48,57.23) v1(36.92,40.55) v1(38.11,59.85) v1(38.35,34.76) v1(39.74,54.46) v1(39.84,62.39) v1(39.77,57.34) v1(42.59,65.47) v1(43.29,56.42) v1(43.27,54.73) v1(44.43,60.94) v1(46.45,56.48) v1(46.9,65.84) v1(47.49,40.1) v1(47.64,42.03) v1(47.59,37.89) v1(47.62,36.13) v1(47.69,31.36) v1(48.15,29.3) v1(48.55,34.78) v1(49.18,45.24) v1(49.45,44.03) v1(49.43,31.32) v1(49.67,42.53) v1(49.67,40.85) v1(49.82,27.38) v1(49.9,29.42) v1(50.11,52.47) v1(50.86,33.12) v1(50.98,45.37) v1(51.75,38.76) v1(51.76,35.77) v1(51.95,31.3) v1(52.33,27.33) v1(52.38,29.34) v1(52.59,45.37) v1(53.04,56.26) v1(53.58,41.61) v1(54.14,45.37) v1(54.49,40.62) v1(54.67,35.05) v1(54.72,32.92) v1(54.72,30.65) v1(54.77,27.92) v1(55.66,39.83) v1(55.87,41.29) v1(57.34,40.26) v1(57.87,29.39) v1(58.2,41.28) v1(59.32,33.58) v1(59.32,30.24) v1(59.32,28.58) v1(60.24,52.34) v1(60.87,37.98) v1(61.33,47.77) v1(62.4,52.34) v1(62.58,46.93) v1(63.54,31.3) v1(63.61,29.77) v1(63.95,23.99) v1(63.97,22.37) v1(64.1,28.79) v1(65.07,20.72) v1(65.45,40.27) v1(65.54,41.96) v1(66.16,24.09) v1(66.21,22.82) v1(66.56,28.53) v1(66.74,19.47) v1(68.11,36.17) v1(71.41,40.16) v1(71.37,34.5) v1(71.37,33.34) v1(71.57,42.38) v1(71.71,45.09) v1(72.17,36.22) v1(72.28,41.11) v1(72.41,43.2) v1(73.09,34.5) v1(74.48,33.25) v1(74.63,42.37) v1(74.63,40.03) v1(76.34,34.57) v1(77.23,41.56) v1(77.96,39.91) v1(77.89,35.94) v1(78.07,29.02) v1(78.85,48.34) v1(78.88,46.71) v1(79.24,30.9) v1(85.36,30.14) v1(85.39,28.41) v1(85.39,26.91) v1(86.99,30.14) v1(87.01,28.41) v1(87.01,26.91) v1(88.54,30.17) v1(88.56,28.44) v1(88.56,26.94) v1(90.24,30.17) v1(90.26,28.44) v1(90.26,26.94) v1(90.67,34.46) v1(91.36,33.64) v1(93.57,30.67) v1(93.69,36.18) v1(94.66,35.02) v1(95.24,28.92) v1(95.65,44.8) v1(97.94,28.95) v1(98.27,31.92) v1(99.48,28.97) v1(100.07,31.92) v1(100.65,25.21) v1(101.01,23.46) v1(101.67,31.05) v1(101.86,35.05) v1(102.48,22.21) v1(102.73,50.17) v1(102.94,29.58) v1(103.44,18.65) v1(103.65,25.36) v1(103.78,27.98) v1(104.05,36.2) v1(106.79,35.51) v1(106.79,33.47) v1(108.19,61.93) v1(108.65,13.97) v1(111.09,30.7) v1(111.11,12.35) v1(111.24,28.97) v1(111.72,65.08) v1(112.76,16.44) v1(115.36,47.11) v1(115.91,35.44) v1(116.17,30.98) v1(116.34,15.24) v1(119.62,43.18) v1(119.62,37.66) v1(119.69,57.61) v1(119.69,53.45) v1(119.69,49.51) v1(119.8,22.51) v2(0.61,49.08) v2(0.61,44.08) v2(0.61,39.08) v2(0.61,34.08) v2(0.61,29.08) v2(0.61,24.08) v2(0.61,19.08) v2(0.86,74.06) v2(0.83,69.08) v2(0.93,71.64) v2(1.01,64.15) v2(1.01,59.58) v2(1.25,12.28) v2(1.25,7.28) v2(1.25,2.28) v2(1.37,75.79) v2(3.05,45.99) v2(3.1,42.23) v2(3.1,39.08) v2(3.36,64.51) v2(3.31,63.3) v2(3.4,10.67) v2(3.4,8.51) v2(3.48,49.62) v2(3.53,28.54) v2(3.69,76.04) v2(3.71,26.41) v2(4.22,6.15) v2(4.52,47.28) v2(4.52,44.49) v2(4.55,40.66) v2(4.57,24.63) v2(4.75,50.89) v2(4.72,19.05) v2(4.78,31.56) v2(4.88,30.24) v2(5.08,27.55) v2(6.15,65.8) v2(6.96,58.01) v2(6.96,55.52) v2(6.91,44.7) v2(7.01,60.11) v2(7.27,24.93) v2(7.32,53.08) v2(7.5,65.8) v2(7.75,76.01) v2(7.78,59.25) v2(7.88,56.92) v2(7.88,54.53) v2(7.88,50.88) v2(8.31,73.3) v2(8.55,16.36) v2(8.75,48.59) v2(8.85,44.86) v2(9.45,52.37) v2(9.7,55.92) v2(9.78,59.43) v2(10.09,53.76) v2(10.22,50.88) v2(10.19,27.86) v2(11.16,76.01) v2(11.51,41.56) v2(11.66,56.1) v2(11.62,48.62) v2(11.66,46.68) v2(11.59,44.01) v2(11.79,52.21) v2(11.94,28.54) v2(12.09,26.13) v2(12.22,53.81) v2(12.65,31.36) v2(12.73,39.41) v2(12.89,8.66) v2(13.02,50.85) v2(13,13.31) v2(13.1,15.95) v2(13.31,68.3) v2(13.31,53.3) v2(14.02,30.73) v2(14.02,28.57) v2(14.35,52.34) v2(14.35,26.18) v2(14.35,24.35) v2(15.21,16.26) v2(15.32,75.86) v2(15.56,13.4) v2(15.68,50.83) v2(16.13,67.99) v2(16.13,66.19) v2(16.13,56.15) v2(17.52,16.28) v2(17.66,75.43) v2(17.64,11.81) v2(17.64,8.61) v2(17.62,5.26) v2(17.62,2.06) v2(17.76,72.59) v2(17.83,57.73) v2(17.86,54.14) v2(17.88,49.93) v2(17.99,41.04) v2(20.46,54.61) v2(20.44,51.64) v2(20.46,45.95) v2(20.46,42.98) v2(20.46,39.95) v2(20.46,37.14) v2(20.52,70.82) v2(20.52,67.97) v2(20.54,65.05) v2(20.54,61.67) v2(20.54,58.27) v2(20.49,48.77) v2(20.49,33.86) v2(20.57,24.45) v2(20.57,21.62) v2(20.59,30.77) v2(20.59,27.66) v2(20.85,11.81) v2(20.85,8.54) v2(20.85,5.54) v2(20.87,15.75) v2(21.43,17.27) v2(23.31,63.3) v2(23.31,58.3) v2(23.31,53.3) v2(23.31,48.3) v2(23.31,43.3) v2(23.31,38.3) v2(23.31,33.3) v2(23.31,28.3) v2(23.31,8.3) v2(25.85,75.95) v2(25.94,73.61) v2(26.76,1.2) v2(27.06,65.28) v2(28.31,63.3) v2(28.31,58.3) v2(28.31,8.3) v2(28.31,3.3) v2(29.91,15.59) v2(31.03,1.2) v2(32.2,15.59) v2(33.04,75.85) v2(33.31,73.3) v2(33.31,53.3) v2(33.31,43.3) v2(33.32,37.58) v2(33.31,33.3) v2(33.31,28.3) v2(33.31,8.3) v2(33.31,3.3) v2(35.53,19.37) v2(35.97,1.2) v2(37.13,19.37) v2(38.31,48.3) v2(38.31,43.3) v2(38.35,37.58) v2(38.27,31.89) v2(38.31,28.3) v2(38.31,8.3) v2(38.31,3.3) v2(39.13,40.55) v2(39.16,12.26) v2(39.19,13.96) v2(40.01,1.2) v2(41.09,75.67) v2(42.49,49.14) v2(43.12,16.37) v2(43.12,14.47) v2(43.07,12.03) v2(43.31,73.3) v2(43.3,52.69) v2(43.31,8.3) v2(43.31,3.3) v2(43.5,25.24) v2(44.8,1.2) v2(45.92,75.67) v2(47.71,43.82) v2(47.97,33.37) v2(48.31,73.3) v2(49.95,1.2) v2(50.43,59.11) v2(51.68,75.67) v2(52.29,25.54) v2(53.31,73.3) v2(53.31,33.3) v2(53.31,3.3) v2(54.15,25.54) v2(54.48,16.93) v2(54.5,15.48) v2(54.86,54.04) v2(55.39,1.22) v2(55.84,44.94) v2(56.46,75.72) v2(57.82,30.91) v2(58.31,73.3) v2(58.31,3.3) v2(60.32,1.15) v2(60.37,75.67) v2(63.31,73.3) v2(63.31,3.3) v2(65.09,1.15) v2(65.35,75.67) v2(68.31,73.3) v2(68.31,3.3) v2(71.09,75.67) v2(71.29,1.17) v2(73.31,73.3) v2(73.31,3.3) v2(76.4,75.67) v2(76.78,1.12) v2(78.31,73.3) v2(78.31,3.3) v2(80.49,1.12) v2(80.92,26.53) v2(82.06,27.12) v2(82.52,75.8) v2(83.31,73.3) v2(83.31,3.3) v2(84.57,1.17) v2(87.97,1.17) v2(88.31,73.3) v2(88.31,3.3) v2(88.66,75.8) v2(92.47,1.17) v2(93.31,73.3) v2(93.31,8.3) v2(93.31,3.3) v2(93.69,75.8) v2(95.67,47.44) v2(97.32,1.17) v2(98.31,73.3) v2(98.31,8.3) v2(98.31,3.3) v2(99.43,75.8) v2(100.47,51.53) v2(101.24,1.2) v2(102.56,53.63) v2(103.31,73.3) v2(103.31,33.3) v2(103.31,8.3) v2(103.31,3.3) v2(104.18,30.85) v2(106.01,28.64) v2(108.31,73.3) v2(108.31,58.3) v2(108.31,53.3) v2(108.31,48.3) v2(108.31,38.3) v2(108.31,18.3) v2(108.31,3.3) v2(108.45,22.42) v2(108.73,24.5) v2(110.66,22.42) v2(111.12,24.45) v2(113.31,73.3) v2(113.31,43.3) v2(113.31,38.3) v2(113.31,33.3) v2(113.5,9.64) v2(113.48,6.24) v2(113.48,3.34) v2(118.31,68.3) v2(118.31,63.3) v2(118.31,13.3) v2(118.31,8.3) v2(118.84,29.71) v2(119.8,25.14) v2(119.8,20.28)
VBAT: length 65
  Top Layer w0.254: v2(46.54,46.69) 58.58,46.69 62.19,43.08 U1.6 63.94,43.08 v2(65.44,43.08)
  Bottom Layer w0.254: R30.1 65.46,44.25 C39.2 65.48,43.12 v2(65.44,43.08) ; J2.6 54.38,10 52,12.37 52,21.41 45.14,28.27 45.14,45.29 v2(46.54,46.69)
VBUS: length 18.8
  Top Layer w0.152: v1(106.37,26.84) R8.2
  Top Layer w0.508: CN5.A4B9 111.7,20.54 110.99,19.83 v4(109.57,19.83) ; 112.73,25.44 110.51,25.44 110.23,25.16 v4(109.57,25.16) 109.57,26.38 D1.1
  Bottom Layer w0.152: v1(106.37,26.84) R8.2 107.05,25.16 v4(109.57,25.16)
  Bottom Layer w0.508: 109.54,25.19 v4(109.57,25.16) v4(109.57,19.83)
VCC: length 64.2
  Top Layer w0.254: v3(11.31,32.61) 11.28,32.58 U6.36 ; U6.1 v3(11.28,38.14) 12.78,38.14 ; v3(5.77,32.66) 5.75,32.64 U6.24 ; v3(7.27,38.17) 7.28,38.18 U6.9
  Top Layer w0.508: U7.5 15.73,57.94 R43.2 14.45,54.93 C14.2 14.39,53.55 16.92,51.02 v3(16.92,46.09) 16.92,41.02 16.23,40.33 J9.1
  Bottom Layer w0.254: C9.2 10.64,37.51 v3(11.28,38.14) ; C11.2 11.29,32.59 v3(11.31,32.61) ; C10.2 5.81,32.62 v3(5.77,32.66) 5.77,36.8 6.01,37.04 C12.2 7.27,37.6 v3(7.27,38.17) ; v3(16.92,46.09) 16.92,41.95 RP1.4
  Bottom Layer w0.381: C10.2 C11.2 9.88,33.88 9.6,34.15 9.6,36.82 9.82,37.04 C9.2
  Bottom Layer w0.508: 14.52,37.04 14.52,34.12 P1.1 ; 14.52,37.04 C8.2 C9.2 ; 14.52,37.04 J9.1
VCC3.5V: length 6
  Top Layer w0.508: U5.5 5.69,56.67 R50.2 5.68,54.93 5.63,54.88 5.74,54.77 D5.2
VDD: length 300.1
  Top Layer w0.254: 65.69,45.8 65.69,45.8 U1.100 65.69,47.33 65.69,48.09 v4(64.93,48.85) ; v3(77.91,30.23) 77.69,30.45 U1.50 ; v2(77.94,45.42) 78.09,45.58 U1.75 ; v3(66.58,30.05) 66.69,30.16 66.69,31.83
  Top Layer w0.508: 65.69,45.8 65.69,45.42 66.91,44.2 v4(73.49,44.2) v3(76.54,44.2) ; v3(75.42,33.53) 73.59,35.36 v4(73.52,35.36) 73.46,35.3 v4(66.8,35.3) ; v4(41.11,10.29) 41.07,10.25 ; 41.07,10.25 B2.1 ; 41.07,10.25 B2.2 45.21,10.25 47.18,8.28 47.18,4.98 49.82,2.34 v4(81.06,2.34) 111.03,2.34 v4(112.02,3.33) ; JP3.2 32.32,59.9 31.78,59.35 31.78,58.68 42.46,58.68 ; JP1.1 41.08,39.17 v4(41.09,39.16) ; v4(57.17,52.82) 52.34,52.82 46.47,58.69 v4(41.09,58.69) 41.09,61.81 46.98,67.69 J1.50
  Bottom Layer w0.254: 63.95,45.88 64.04,45.97 64.04,47.09 63.76,47.37 C31.2 ; v3(66.58,30.05) 66.85,30.32 C32.2 ; 75.73,30.27 77.87,30.27 v3(77.91,30.23)
  Bottom Layer w0.381: J2.28 81.04,8.03 81.04,2.37 v4(81.06,2.34) ; 51.12,72.06 50.53,71.48 50.53,68.92 J1.50
  Bottom Layer w0.508: v4(112.02,3.33) 112.02,7.55 J2.50 ; v3(75.42,33.53) 75.73,33.23 75.73,30.27 ; J1.25 77.88,72.14 51.19,72.14 51.12,72.06 ; v4(41.11,10.29) 41.09,10.31 v4(41.09,39.16) v4(41.09,58.69) ; v3(76.54,44.2) 76.55,44.21 C34.2 v2(77.94,45.42) ; v4(73.49,44.2) 73.52,44.17 v4(73.52,35.36) ; v4(57.17,52.82) 57.3,52.82 61.09,49.04 C30.2 C31.2 64.74,49.04 v4(64.93,48.85) ; C32.2 66.85,33.96 L1.1 v4(66.8,35.3) 66.8,36.66 L2.1
VDDA: length 6.4
  Top Layer w0.254: v2(62.29,34.83) 62.54,35.08 U1.22
  Bottom Layer w0.254: v2(62.29,34.83) 61.91,34.45 C36.2 63.64,33.85 C35.2 65.26,33.88 65.4,34.01
ATLINK_5V: length 86.1
  Top Layer w0.508: CN6.A4B9 11.75,67.04 v4(11.79,67.07) 11.79,65.93 12.04,65.68 F2.1 ; 6.85,67.07 6.85,66.93 6.84,66.95 6.85,67.07 ; 6.85,67.07 CN6.B4A9
  Bottom Layer w0.508: D3.1 15.49,11.7 14.97,12.22 3.54,12.22 2.29,13.47 2.29,65.02 4.35,67.07 v4(6.84,67.07) v4(11.79,67.07) 12.36,66.5 TP3.1
ATLK_RX: length 61.8
  Top Layer w0.152: 13.22,17.27 13.22,17.15 ; 13.22,17.27 13.2,17.26 13.22,17.15 ; 13.22,17.27 13.22,17.28 13.22,17.78 13.21,17.79 R48.2 ; 13.22,17.15 16.53,17.15 17.7,18.32 26.71,18.32 27.75,19.36 29.27,19.36 30.55,18.08 CN2.10 33.55,20.64 R10.1 ; CN7.10 2.86,3.03 2.86,6.3 4.67,8.1 v2(4.67,16.64)
  Bottom Layer w0.152: v2(4.67,16.64) 5.17,17.15 v2(13.2,17.15)
ATLK_TX: length 60.5
  Top Layer w0.152: 32.51,22.14 CN2.8 29.74,21.87 27.75,21.87 25.55,19.68 16.76,19.68 15.55,18.47 v2(15.44,18.47) ; 32.51,22.14 32.44,22.14 ; 32.51,22.14 R9.1 ; v2(5.43,17.86) 5.43,11.81 5.4,11.79 5.4,3.03 CN7.8 ; 11.64,18.47 11.64,18.33 11.65,18.35 11.64,18.47 ; 11.64,18.47 R47.2
  Bottom Layer w0.152: v2(5.43,17.86) 6.04,18.47 v2(11.65,18.47) v2(15.44,18.47)
BOOT0: length 140.3
  Top Layer w0.152: 8.41,19.74 8.42,19.64 8.41,19.62 8.41,19.74 ; 8.41,19.74 R45.2 ; R31.2 v1(42.38,41.73) ; CN7.4 10.58,2.93 v2(10.58,19.71) ; CN2.4 42.38,25.7 v1(42.39,25.69) ; J1.44 56.92,65.42 55.51,64.01 55.51,61.45 v2(61.55,55.4) 61.63,55.32 67.78,55.32 68.69,54.41 U1.94
  Bottom Layer w0.152: v2(8.42,19.74) 8.45,19.71 v2(10.58,19.71) v2(15.41,19.71) 16.4,19.71 16.78,19.33 20.69,19.33 21.96,20.6 21.96,23.65 22.72,24.41 29.14,24.41 30.43,25.7 CN2.4 ; v1(42.39,25.69) v1(42.39,41.73) 42.39,47.26 50.53,55.4 v2(61.55,55.4)
CC1: length 7.9
  Top Layer w0.152: CN6.A5 10.55,71.04 v2(11.36,71.78) 11.37,71.79 11.3,71.79
  Bottom Layer w0.152: v2(11.36,71.78) 14.39,71.78 14.39,71.77 14.95,71.77 R20.1
CC2: length 13.2
  Top Layer w0.152: 8.28,72.33 8.32,72.33 8.29,72.33 8.28,72.33 ; 8.28,72.33 7.55,71.6 CN6.B5
  Bottom Layer w0.152: R21.1 15.92,72.34 8.32,72.34 v2(8.3,72.32)
EGND: length 39
  Top Layer w0.508: CN5.14 CN5.16 CN5.15 CN5.13 ; CN1.SH1 CN1.SH2
  Bottom Layer w0.508: CN5.14 113.69,27.35 113.69,29.42 113.71,29.44 113.71,31.37 111.65,33.43 CN1.SH2
EGND2: length 20.9
  Top Layer w0.508: CN6.16 CN6.15 CN6.13
  Bottom Layer w0.508: 2.79,69.74 2.93,69.89 CN6.14 CN6.16 ; 2.79,69.74 2.79,71.44 ; 2.79,69.74 2.79,69.74
LD1: length 18.4
  Top Layer w0.152: U6.10 6.78,41.16 6.18,41.76 6.18,48.09 7.25,49.15 14.16,49.15 14.5,48.82 14.5,48.01
LD2: length 22.4
  Top Layer w0.152: U6.11 6.28,41.13 5.8,41.61 5.8,48.24 7.07,49.51 14.88,49.51 15.47,48.91 15.47,47.07 LD2.2
LD3: length 26.2
  Top Layer w0.152: LD3.2 14.56,44.14 15.19,44.14 15.83,44.78 15.83,49.21 15.16,49.89 6.92,49.89 5.42,48.39 5.42,41.43 5.78,41.07 U6.12
LD4: length 35.2
  Top Layer w0.152: U6.19 5.15,35.14 5.46,35.45 5.46,38.45 5.04,38.87 5.04,48.52 6.79,50.27 15.35,50.27 16.19,49.43 16.19,43.03 15.41,42.24 LD4.2
M-ATLK_RX: length 10.9
  Top Layer w0.152: R48.1 13.21,23.74 12.7,24.25 11.91,24.25 8.25,27.9 8.25,29.63 8.78,30.16 U6.31
M-ATLK_TX: length 10
  Top Layer w0.152: R47.1 11.64,23.79 7.74,27.68 7.74,29.68 8.28,30.22 U6.30
M-NRST: length 29.3
  Top Layer w0.152: U6.7 8.28,38.27 v2(8.46,38.09)
  Bottom Layer w0.152: P1.4 17.83,26.38 17.83,40.12 17.4,40.56 12.17,40.56 9.7,38.09 v2(8.46,38.09) 8.49,38.07 C22.2
M-SWCLK: length 9.5
  Top Layer w0.152: P1.3 17.58,28.67 17.58,30.57 17.1,31.06 15.17,31.06 13.58,32.64 U6.37
M-SWDIO: length 7.6
  Top Layer w0.152: P1.2 14.73,29.86 14.14,29.28 11.05,29.28 10.28,30.05 U6.34
M-USB_D+: length 44.4
  Top Layer w0.152: v2(9.81,29.53) 9.81,29.58 9.78,29.61 U6.33 ; v2(8.46,60.52) 8.49,60.55 R11.2
  Bottom Layer w0.152: v2(8.46,60.52) 8.46,53.39 3.63,48.56 3.63,29.89 4.95,28.57 9.5,28.57 9.81,28.88 v2(9.81,29.53)
M-USB_D-: length 43.4
  Top Layer w0.152: 9.28,29.05 9.25,29.04 9.28,29.01 9.28,29.05 ; 9.28,29.05 U6.32 ; R12.2 9.07,62.21 v2(9.07,60.93)
  Bottom Layer w0.152: v2(9.25,29.05) 5.08,29.05 3.99,30.14 3.99,48.41 9.07,53.49 v2(9.07,60.93)
M_ATLK_BOOT0: length 8.8
  Top Layer w0.152: R45.1 8.41,25.37 6.78,27 U6.27
M_ATLK_NRST: length 9.3
  Top Layer w0.152: U6.28 7.28,27.44 10.01,24.71 R46.1
M_ATLK_SWCLK: length 8.3
  Top Layer w0.152: U6.25 5.78,24.49 5.23,23.94 R41.1
M_ATLK_SWDIO: length 8.3
  Top Layer w0.152: R44.1 6.81,23.87 6.28,24.4 U6.26
M_ATLK_SWO: length 16.6
  Top Layer w0.152: R52.1 3.66,24.76 2.92,25.49 2.92,37.76 3.3,38.14 U6.13
NRST: length 180.5
  Top Layer w0.152: v2(58.97,20.28) 59.93,21.24 59.93,30.89 59.31,31.51 C27.2 59.95,33.21 59.95,36.27 62.76,39.08 U1.14 ; 58.96,15.71 58.96,13.08 60.72,11.33 62.52,11.33 J2.14 ; 58.96,15.71 57.78,15.71 55.72,17.77 41.04,17.77 34.82,11.55 33.7,11.55 ; 58.96,15.71 58.96,20.29 ; v1(82.03,33.49) 88.49,33.49 92.1,37.11 J7.5 ; 33.7,11.55 B1.2 ; 33.7,11.55 v1(33.7,11.55) ; v2(9.97,17.76) 10,17.78 10,21.5 R46.2 ; 6.76,17.82 6.76,17.71 ; 6.76,17.71 6.75,17.72 6.75,17.82 ; 6.76,17.71 CN7.7 ; CN2.7 28.3,20.46 27.8,20.46 26.35,19.01 17.1,19.01 v1(15.85,17.76) ; 6.76,17.77 v2(6.75,17.76)
  Top Layer w0.508: B1.1 B1.2
  Bottom Layer w0.152: CN2.7 29.72,19.34 32.63,19.34 33.7,18.28 v1(33.7,11.55) ; v1(15.85,17.76) v2(9.97,17.76) v2(6.75,17.76) ; v2(58.97,20.28) 63.81,25.12 77.91,25.12 82.03,29.25 v1(82.03,33.49) ; 65.92,14.24 65.92,11.71 64.54,10.33 J2.14
OTGFS1_D+: length 29.3
  Top Layer w0.152: CN5.A6 113.77,22.74 113.96,22.93 113.96,23.56 113.78,23.74 CN5.B6 106.87,23.74 R54.2 107.18,25.04 107.18,29.58 105.22,31.54 105.22,38.69 CN1.3
OTGFS1_D-: length 27.3
  Top Layer w0.152: CN5.B7 111.62,22.24 111.4,22.47 111.4,23.23 111.4,23.24 ; R55.2 106.96,23.24 v1(107.74,23.24) 111.4,23.24 ; v1(107.74,24.4) 107.74,29.76 105.78,31.71 105.78,38.34 106.87,39.43 CN1.2 ; 111.4,23.24 CN5.A7
  Bottom Layer w0.152: v1(107.74,23.24) 107.74,24.4
PA0: length 87.5
  Top Layer w0.152: U1.23 62.88,34.58 62.09,33.78 62.09,19.59 64.27,17.4 68.72,17.4 69.56,16.56 74,16.56 74.79,15.78 74.79,11.69 75.96,10.51 v2(75.98,10.51) 75.98,8.03 J2.23
  Bottom Layer w0.152: J2.23 77.24,5.78 75.8,4.35 46.92,4.35 45.53,5.74 41.86,5.74 ; v2(75.98,10.51) 76.6,11.13 80.59,11.13 83.7,14.24
PA1: length 50.2
  Top Layer w0.152: U1.24 62.94,34.08 62.44,33.58 62.44,20.15 64.65,17.94 68.68,17.94 68.68,17.94 69.7,16.92 76.39,16.92 77.33,15.98 77.33,9.4 J2.24
  Bottom Layer w0.152: J2.24 78.63,10.7 83.83,10.7 86.24,13.11 86.24,14.24
PA2: length 95.7
  Top Layer w0.152: v2(79.33,54.92) v2(79.33,49.58) ; J2.25 78.42,8.13 78.42,9.99 80.17,11.74 80.17,15.19 78.09,17.27 69.85,17.27 68.75,18.38 68.74,18.37 65.14,18.37 62.8,20.7 62.8,33.3 63.07,33.58 U1.25 65.05,33.58 65.31,33.84 65.31,35.54 67.24,37.47 77.78,37.47 v2(77.84,37.52)
  Bottom Layer w0.152: v2(77.84,37.52) 79.69,39.37 79.69,49.23 v2(79.33,49.58) ; 93.86,62.5 93.85,62.5 86.27,54.92 v2(79.33,54.92)
PA3: length 89.1
  Top Layer w0.152: v2(80.02,54.31) 80.02,50.4 v2(80.05,50.37) ; J2.26 80.63,10.16 80.63,15.7 78.7,17.63 70,17.63 65.14,22.49 65.14,30.25 65.69,30.81 U1.26 65.69,35.15 67.37,36.83 77.28,36.83 v2(77.3,36.86)
  Bottom Layer w0.152: v2(80.05,50.37) 80.05,38.71 78.19,36.86 v2(77.3,36.86) ; 96.4,62.5 94.41,60.51 92.9,60.51 86.7,54.31 v2(80.02,54.31)
PA4: length 46.6
  Top Layer w0.152: J2.29 83.58,8.06 83.58,9.99 81.14,12.42 81.14,15.9 79.06,17.99 70.37,17.99 67.19,21.17 U1.29
  Bottom Layer w0.152: 88.78,14.24 88.78,12.78 86.06,10.06 86.06,8.26 84.86,7.05 J2.29
PA5: length 68.8
  Top Layer w0.152: v2(68.51,34.42) 67.69,33.59 U1.30 67.69,21.33 70.67,18.34 79.39,18.34 81.57,16.16 81.57,12.73 84.86,9.44 J2.30
  Bottom Layer w0.152: v2(68.51,34.42) 68.9,34.8 68.9,50.38 61.86,57.42 61.86,62.5
PA6: length 72.2
  Top Layer w0.152: J2.31 86.14,8.03 86.14,10.31 84.87,11.58 83.43,11.58 82.1,12.91 82.1,16.67 80.07,18.7 71.18,18.7 68.19,21.69 U1.31 68.19,33.28 v2(68.49,33.58)
  Bottom Layer w0.152: v2(68.49,33.58) 69.25,34.34 69.25,50.53 64.4,55.38 64.4,62.5
PA7: length 68.7
  Top Layer w0.152: J2.32 87.4,11.14 85,13.54 85,15.9 81.85,19.05 71.71,19.05 68.69,22.08 U1.32 68.69,32.99 v2(69.5,33.81)
  Bottom Layer w0.152: v2(69.5,33.81) 69.61,33.91 69.61,50.68 66.56,53.72 66.56,62.12 66.94,62.5
PA8: length 56.5
  Top Layer w0.152: J1.17 91.17,69 91.17,67.26 94.04,64.4 ; 94.04,64.4 95.08,63.35 95.08,58.8 86.93,50.65 86.93,44.58 83.43,41.09 81.2,41.09 80.71,41.58 U1.67 ; 94.04,64.4 94.03,64.39 v2(94.02,64.39)
  Bottom Layer w0.152: v2(94.02,64.39) 80.52,64.39 78.62,62.5
PA9: length 79.8
  Top Layer w0.152: 79.44,42.08 80.82,42.08 81.22,41.67 v1(82,41.67) 83.3,41.67 86.27,44.63 86.27,50.88 92.59,57.2 92.59,63.61 91.13,65.08 ; J1.18 89.94,66.27 91.13,65.08 ; v2(91.12,65.08) 91.13,65.08 ; v1(82.67,31.74) 93.85,31.74 96.79,28.79 96.79,27.14
  Bottom Layer w0.152: v1(82.67,31.74) 82.67,41 v1(82,41.67) ; 74.56,62.5 77.14,65.08 v2(91.12,65.08)
PA10: length 113
  Top Layer w0.152: J1.19 88.91,68.72 88.91,65.91 91.32,63.5 91.32,56.87 v2(89.47,55.02) 85.68,51.23 85.68,44.74 83.23,42.28 v2(81.4,42.28) 81.3,42.28 81,42.58 U1.69 ; 44.45,22.11 44.5,22.16 v2(58.18,22.16)
  Bottom Layer w0.152: v2(58.18,22.16) 62.13,26.11 76.54,26.11 81.4,30.97 v2(81.4,42.28) ; J8.3 v2(89.47,55.02)
PA11: length 39.2
  Top Layer w0.152: R55.1 104.43,23.1 v1(103.62,23.1) ; U1.70 82.94,43.08 v1(83.38,43.52) 84.69,44.83 R32.2
  Bottom Layer w0.152: v1(83.38,43.52) 96.71,30.19 99.79,30.19 101.85,28.13 101.85,24.48 103.22,23.1 v1(103.62,23.1)
PA11_E: length 24.2
  Top Layer w0.152: R32.1 84.69,51.29 90.08,56.67 90.08,63.55 87.4,66.23 J1.20
PA12: length 38
  Top Layer w0.152: v1(103.6,23.76) 104.4,23.76 R54.1 ; U1.71 82.5,43.58 v1(83.35,44.43) R33.2
  Bottom Layer w0.152: v1(103.6,23.76) 103.24,23.76 102.35,24.65 102.35,28.39 100.04,30.7 97.08,30.7 v1(83.35,44.43)
PA12_E: length 26.2
  Top Layer w0.152: J1.21 86.17,68.93 86.17,64.9 87.51,63.55 87.51,55.02 83.35,50.85 R33.1
PA13/SWDIO: length 136
  Top Layer w0.152: J1.22 84.97,67.58 84.97,53.8 82.09,50.91 82.09,45.72 80.44,44.08 77.54,44.08 v2(76.34,42.88) ; v2(59.27,26.62) 32.67,26.62 32.29,27 29.76,27 CN2.3 ; v2(6.8,20.45) 6.8,21.5 R44.2 ; CN7.3 11.84,17.16 12.39,17.71 v2(12.39,20.45)
  Bottom Layer w0.152: CN2.3 22.48,25.7 21.4,24.62 21.4,21.04 20.45,20.09 17.46,20.09 17.08,20.47 14.62,20.47 14.6,20.45 v2(12.39,20.45) v2(6.8,20.45) ; v2(76.34,42.88) 76.34,36.02 72.53,32.21 72.53,27.59 71.56,26.62 v2(59.27,26.62)
  vias: v2(14.7,20.47)
PA14/SWCLK: length 133
  Top Layer w0.152: v2(58.41,24.45) 32.08,24.45 32.06,24.44 29.73,24.44 CN2.5 ; J1.26 79.89,67.58 79.89,61.32 78.32,59.74 78.32,49.55 77.69,48.92 U1.76 77.69,46.36 v2(76.69,45.37) ; CN7.5 9.3,19.09 v2(9.31,19.1) ; v2(5.25,20.47) 5.25,20.47 5.23,20.46 R41.2
  Bottom Layer w0.152: v2(76.69,45.37) 76.69,45.34 75.52,44.17 75.52,35.94 71.74,32.16 71.74,27.85 71.22,27.33 59.04,27.33 58.41,26.71 v2(58.41,24.45) ; v2(5.25,20.47) 5.25,20.45 6.6,19.1 v2(9.31,19.1) v2(14.7,19.1) 16.21,19.1 16.62,18.7 21.09,18.7 22.49,20.09 22.49,22.51 23.14,23.16 CN2.5
PA15: length 31
  Top Layer w0.152: U1.77 77.19,57.28 77.33,57.42 v2(77.33,57.81) 77.33,59.24 77.23,59.34 77.23,63.71 78.47,64.95 78.47,69 J1.27
  Bottom Layer w0.152: v2(77.33,57.81) 77.28,57.77 70.38,57.77
PB0: length 43.9
  Top Layer w0.152: 70.19,31.83 70.19,22.81 72.88,20.12 89.06,20.12 91.32,17.86 91.32,14.24
  Bottom Layer w0.152: J2.35 91.17,8.08 91.17,14.08 91.32,14.24
PB1: length 41.9
  Top Layer w0.152: J2.36 92.59,9.42 92.59,15.3 92.06,15.84 92.06,19.18 90.76,20.48 73.29,20.48 70.69,23.08 U1.36
PB2: length 47.5
  Top Layer w0.152: U1.37 71.19,23.52 73.87,20.83 93.38,20.83 95.13,19.08 95.13,12.58 93.79,11.23 93.79,8 J2.37
PB3/SWO: length 113.8
  Top Layer w0.152: CN2.6 33.15,23.16 33.15,23.15 v2(57.8,23.15) ; U1.89 71.19,45.89 v2(71.21,45.88) ; v2(63.15,60.53) 65.57,58.12 69.45,58.12 71.16,56.42 v2(71.16,55.53) 71.16,47.36
  Bottom Layer w0.152: v2(71.16,55.53) 85.29,55.53 88.78,59.02 88.78,62.5 ; v2(57.8,23.15) 57.8,27.21 58.51,27.92 68.31,27.92 70.65,30.25 70.65,45.32 v2(71.21,45.88) ; v2(63.15,60.53) 63.15,67.14 63.03,67.27 63.03,69.21 J1.39
PB4: length 46.7
  Top Layer w0.152: J1.40 62,64.97 60.64,63.6 60.64,61.14 64.12,57.66 69.15,57.66 v2(70.19,56.62) 70.57,56.24 70.57,54.62 70.69,54.51 U1.90
  Bottom Layer w0.152: 83.7,62.5 83.7,57.84 82.48,56.62 v2(70.19,56.62)
PB5: length 52.2
  Top Layer w0.152: v2(60.64,59.79) 63.28,57.15 68.54,57.15 v2(69.63,56.06) 70.19,55.5 70.19,47.33
  Bottom Layer w0.152: J1.41 60.64,69.06 v2(60.64,59.79) ; v2(69.63,56.06) 84.11,56.06 86.24,58.19 86.24,62.5
PB6: length 30.5
  Top Layer w0.152: U1.92 69.69,55.06 68.44,56.31 v2(68.44,56.34) 63.21,56.34 v2(59.19,60.35)
  Bottom Layer w0.152: v2(59.19,60.35) 58.05,61.5 58.05,63.81 59.46,65.22 J1.42 ; R38.2 68.42,56.36 v2(68.44,56.34)
PB7: length 31.4
  Top Layer w0.152: U1.93 69.19,54.8 68.21,55.78 62.57,55.78 58.02,60.33 58.02,66.58 58.2,66.75 58.2,68.95 J1.43
PB8: length 95.3
  Top Layer w0.152: J1.45 53.1,68.95 53.1,63.89 51.7,62.5 51.7,62.49 53.47,60.71 55.05,60.71 60.94,54.82 67.42,54.82 v2(68.03,54.21) 68.19,54.05 U1.95
  Bottom Layer w0.152: R36.2 97.09,19.66 95.37,21.38 84.85,21.38 83.84,22.39 83.84,41.32 81.91,43.25 81.91,50.69 78.87,53.72 68.51,53.72 v2(68.03,54.21)
PB9: length 85.7
  Top Layer w0.152: 67.69,53.46 67.66,53.46 66.84,54.28 60.06,54.28 v2(54.31,60.02) ; 67.69,53.46 67.69,53.52 ; 67.69,53.46 U1.96
  Bottom Layer w0.152: v2(67.57,53.52) 67.88,53.22 78.64,53.22 81.48,50.38 81.48,43.09 83.28,41.29 83.28,22.04 84.55,20.77 91.86,20.77 92.57,20.06 R35.2 ; v2(54.31,60.02) 54.31,62.42 54.24,62.5 54.38,62.64 J1.46
PB10: length 83.1
  Top Layer w0.152: 81.16,62.5 81.16,60.83 80.71,60.38 80.71,47.4 ; v2(77.71,33.68) 77.66,33.63 76.79,33.63 76.19,33.03 U1.47 76.19,26.03 77.84,24.39 95.73,24.39 106.36,13.75 106.36,8.13 J2.47
  Bottom Layer w0.152: v2(77.71,33.68) 79.89,33.68 80.71,34.5 v2(80.71,47.42)
PB11: length 70.6
  Top Layer w0.152: J2.48 107.72,12.9 95.87,24.74 78.11,24.74 76.69,26.16 76.69,32.64 77.12,33.07 78.24,33.07 78.96,32.35 97.1,32.35 J7.8
PB12: length 62.1
  Top Layer w0.152: U1.51 80.53,33.58 81.27,32.83 95.05,32.83 J7.7 98,35.79 100.39,35.79 101.11,36.51 101.11,38.13 105.47,42.49 105.47,60.91 111.54,66.98 111.54,68.95 J1.1
PB13: length 57.3
  Top Layer w0.152: U1.52 87.9,34.08 93.47,39.65 J7.3 98.05,38.38 100.39,38.38 104.94,42.93 104.94,62.54 110.09,67.69 J1.2
PB14: length 57.5
  Top Layer w0.152: v2(106.38,65.92) 103.9,63.43 103.9,43.56 101.28,40.95 98.02,40.95 J7.1 94.77,40.18 93.32,40.18 87.72,34.58 U1.53
  Bottom Layer w0.152: v2(106.38,65.92) 106.38,68.9 J1.3
PB15: length 55.2
  Top Layer w0.152: v1(94.51,40.91) 93.31,40.91 87.48,35.08 U1.54 ; J7.4 100.79,39.65 104.38,43.23 104.38,62.94 107.72,66.29 J1.4
  Bottom Layer w0.152: J7.4 98.06,40.91 v1(94.51,40.91)
PC0: length 73.7
  Top Layer w0.152: J2.15 67.05,6.77 65.8,8.03 65.8,9.68 62.21,13.26 62.21,15.62 60.31,17.53 60.31,36.13 62.76,38.58 U1.15
  Bottom Layer w0.152: 95.54,18.89 94.87,18.89 94.37,18.39 94.37,17.1 93.71,16.44 82.56,16.44 81.75,15.62 81.75,13.13 80.25,11.64 69.99,11.64 68.34,9.99 68.34,8.03 J2.15
PC1: length 63.4
  Top Layer w0.152: U1.16 62.76,38.07 60.66,35.98 60.66,17.88 62.85,15.69 63.57,15.69 64.68,14.58 64.68,12.98 67.08,10.58 J2.16
  Bottom Layer w0.152: 90.99,18.97 90.12,18.97 88.05,16.89 82.13,16.89 81.11,15.88 81.11,13.19 80.02,12.09 69.86,12.09 J2.16
PC2: length 38
  Top Layer w0.152: U1.17 62.77,37.58 61.02,35.83 61.02,18.27 63.24,16.05 66.16,16.05 67.17,15.04 67.17,12.91 68.28,11.79 68.28,8.11 J2.17
PC3: length 35.5
  Top Layer w0.152: U1.18 62.77,37.08 61.38,35.68 61.38,18.85 63.79,16.44 68.23,16.44 69.62,15.05 J2.18
PC4: length 41
  Top Layer w0.152: J2.33 88.76,7.95 88.76,11.69 87.46,12.98 87.46,16.77 84.82,19.41 72.22,19.41 69.19,22.44 U1.33
PC5: length 39.6
  Top Layer w0.152: J2.34 89.94,17.31 87.49,19.76 72.63,19.76 69.69,22.7 U1.34
PC6: length 44.3
  Top Layer w0.152: U1.63 84.61,39.58 89.34,44.3 89.34,49.74 99.48,59.87 99.48,64.57 97.75,66.3 96.94,66.3 96.22,67.01 96.22,69.03 J1.13
PC7: length 67.7
  Top Layer w0.152: J1.14 95.02,66.92 96.19,65.75 97.58,65.75 98.99,64.34 98.99,60.21 88.73,49.94 88.73,44.38 84.28,39.93 80.68,39.93 80.53,40.08 U1.64
  Bottom Layer w0.152: 72.02,62.5 72.02,63.96 73.9,65.84 93.89,65.84 95.02,66.97 J1.14
PC8: length 44.2
  Top Layer w0.152: J1.15 93.71,69 93.71,67.11 95.72,65.1 97.5,65.1 98.51,64.09 98.51,60.51 88.15,50.15 88.15,44.43 84,40.29 80.82,40.29 80.53,40.58 79.44,40.58
PC9: length 40.9
  Top Layer w0.152: J1.16 92.48,67.37 95.31,64.54 97.32,64.54 98.03,63.83 98.03,60.86 87.54,50.37 87.54,44.46 83.72,40.64 80.97,40.64 80.54,41.08 U1.66
PC10: length 20.6
  Top Layer w0.152: J1.28 77.28,67.66 77.28,65.92 76.82,65.46 76.82,60.02 76.69,59.89 76.69,47.33
PC11: length 23.7
  Top Layer w0.152: U1.79 76.19,60.13 76.44,60.38 76.44,65.94 75.96,66.42 75.96,68.98 J1.29
PC12: length 21.1
  Top Layer w0.152: J1.30 74.7,66.54 76.03,65.2 76.03,60.99 75.69,60.65 U1.80
PC13: length 79.6
  Top Layer w0.152: U1.7 62.12,42.58 58.72,45.98 v2(47,45.98)
  Bottom Layer w0.152: v2(47,45.98) 45.68,44.66 45.68,28.55 52.64,21.59 52.64,12.83 55.56,9.91 55.56,8.13 J2.7 55.31,5.16 47.61,5.16 45.45,7.32 41.65,7.32
PC14/LEXT_IN: length 12.9
  Top Layer w0.152: 58.28,44.1 58.28,44.15 58.66,44.15 v2(59.86,42.94) 60.73,42.08 63.94,42.08
  Bottom Layer w0.152: R24.1 58,47.35 59.86,45.48 v2(59.86,42.94)
PC14_E: length 50.3
  Bottom Layer w0.152: R24.2 49.36,47.35 46.11,44.1 46.11,28.75 53.15,21.71 53.15,13.08 J2.8
PC15/LEXT_OUT: length 11.4
  Top Layer w0.152: 58.3,42.47 v2(59.19,42.47) 60.09,41.58 U1.9
  Bottom Layer w0.152: v2(59.19,42.47) 59.19,45.16 58.38,45.98 R25.1
PC15_E: length 52.5
  Bottom Layer w0.152: J2.9 59.46,6.85 58.12,8.18 58.12,9.91 53.58,14.46 53.58,21.82 46.47,28.93 46.47,43.64 48.8,45.98 R25.2
PD0: length 24.4
  Top Layer w0.152: U1.81 75.19,58.22 73.26,60.15 73.26,66.33 73.49,66.56 73.49,68.9 J1.31
PD1: length 22.6
  Top Layer w0.152: U1.82 74.69,57.84 70.75,61.78 70.75,64.65 72.16,66.06 J1.32
PD2: length 24.8
  Top Layer w0.152: U1.83 74.19,57.55 v2(70.72,61.01)
  Bottom Layer w0.152: v2(70.72,61.01) 70.7,61.04 70.7,69.16 J1.33
PD3: length 23.8
  Top Layer w0.152: J1.34 69.62,65.31 68.23,63.92 68.23,61.87 69.14,60.96 69.71,60.96 70.27,60.4 70.7,60.4 73.69,57.41 73.69,47.33
PD4: length 26.3
  Top Layer w0.152: U1.85 73.19,57.25 70.5,59.95 69.25,59.95 v2(68.18,61.01)
  Bottom Layer w0.152: v2(68.18,61.01) 68.18,66.86 68.36,67.03 68.36,68.95 J1.35
PD5: length 25.4
  Top Layer w0.152: U1.86 72.69,57.19 70.37,59.52 67.75,59.52 65.67,61.6 65.67,63.82 67.08,65.23 J1.36
PD6: length 28.1
  Top Layer w0.152: U1.87 72.19,57.06 70.22,59.03 66.99,59.03 v2(65.64,60.38)
  Bottom Layer w0.152: J1.37 65.82,68.95 65.82,66.75 65.67,66.6 65.67,60.4 v2(65.64,60.38)
PD7: length 26.7
  Top Layer w0.152: U1.88 71.69,56.77 69.86,58.6 66.13,58.6 63.15,61.57 63.15,63.58 64.54,64.97 J1.38
PD8: length 50.3
  Top Layer w0.152: J1.5 106.44,68.98 106.44,66.98 103.41,63.96 103.41,57.97 94.14,48.7 94.14,43.57 86.15,35.58 U1.55
PD9: length 46.1
  Top Layer w0.152: U1.56 85.94,36.08 93.61,43.75 93.61,48.88 102.93,58.2 102.93,64.37 105.18,66.62 J1.6
PD10: length 47.9
  Top Layer w0.152: U1.57 85.75,36.58 93.03,43.85 93.03,49.05 102.42,58.45 102.42,65.36 103.72,66.65 103.72,69.16 J1.7
PD11: length 43.8
  Top Layer w0.152: U1.58 85.54,37.08 92.44,43.97 92.44,49.18 101.91,58.66 101.91,66.97 J1.8
PD12: length 45.8
  Top Layer w0.152: J1.9 101.43,68.9 101.43,58.94 91.88,49.38 91.88,44.1 85.36,37.58 U1.59
PD13/LED2: length 100.5
  Top Layer w0.152: LED2.2 34.1,47.73 36.85,50.49 63.54,50.49 64.39,49.63 v2(65.67,49.63) ; v2(66.08,39.4) 67.4,38.07 U1.60 85.14,38.07 91.25,44.18 91.25,49.44 100.92,59.11 100.92,65.56 100.1,66.38 J1.10
  Bottom Layer w0.152: v2(65.67,49.63) 66.33,48.97 66.33,41.61 66.08,41.35 v2(66.08,39.4)
PD14/LED3: length 102.2
  Top Layer w0.152: v2(66.61,40.01) 68.04,38.58 U1.61 84.98,38.58 90.61,44.2 90.61,49.51 100.47,59.37 100.47,65.13 98.99,66.6 98.99,68.8 J1.11 ; v2(65.44,50.35) 64.6,50.35 63.9,51.04 35.48,51.04 34.35,49.92 LED3.2
  Bottom Layer w0.152: v2(65.44,50.35) 65.77,50.35 66.69,49.43 66.69,41.31 66.56,41.19 66.56,40.06 v2(66.61,40.01)
PD15/LED4: length 97.9
  Top Layer w0.152: J1.12 97.56,67.25 99.96,64.85 99.96,59.62 90.03,49.69 90.03,44.33 84.77,39.08 U1.62 68.79,39.08 v2(67.12,40.74) ; v2(64.96,50.93) 64.32,51.57 35.58,51.57 35.05,52.1 LED4.2
  Bottom Layer w0.152: v2(67.12,40.74) 67.04,40.82 67.04,49.58 65.69,50.93 v2(64.96,50.93)
PE0: length 34.1
  Top Layer w0.152: U1.97 67.19,52.41 65.9,53.7 59.52,53.7 v2(55.53,57.69)
  Bottom Layer w0.152: J1.47 51.98,70.23 53.27,68.94 55.03,68.94 55.53,68.43 v2(55.53,57.69)
PE1: length 30.4
  Top Layer w0.152: v2(52.99,60.15) 52.99,59.13 59.01,53.11 65.59,53.11 66.69,52.02 66.69,47.33
  Bottom Layer w0.152: J1.48 52.99,66.54 v2(52.99,60.15)
PE2: length 68.6
  Top Layer w0.152: U1.1 62.34,45.58 58.46,49.46 v2(47.36,49.46)
  Bottom Layer w0.152: v2(47.36,49.46) 45.43,49.46 45.22,49.25 45.22,49.25 43.04,47.07 43.04,26.85 49.62,20.27 49.62,11.61 47.71,9.71 47.71,7.37 48.31,6.77 J2.1
PE3: length 63.4
  Top Layer w0.152: v2(46.59,48.9) 58.51,48.9 62.33,45.08 U1.2
  Bottom Layer w0.152: J2.2 49.3,10.36 50.07,11.12 50.07,20.5 43.5,27.07 43.5,46.75 45.52,48.77 45.53,48.77 45.65,48.9 v2(46.59,48.9)
PE4: length 65.4
  Top Layer w0.152: U1.3 62.33,44.58 58.52,48.39 v2(47.97,48.39)
  Bottom Layer w0.152: J2.3 50.56,8.06 50.56,20.72 43.9,27.38 43.9,46.41 45.88,48.39 v2(47.97,48.39)
PE5: length 61.8
  Top Layer w0.152: 63.94,44.08 62.33,44.08 58.55,47.86 v2(46.54,47.86)
  Bottom Layer w0.152: v2(46.54,47.86) 46.52,47.83 46.11,47.83 44.28,46 44.28,27.63 51.06,20.86 51.06,11.59 51.84,10.8 J2.4
